# EAGLE design M623A (EAGLE 6.6.0)
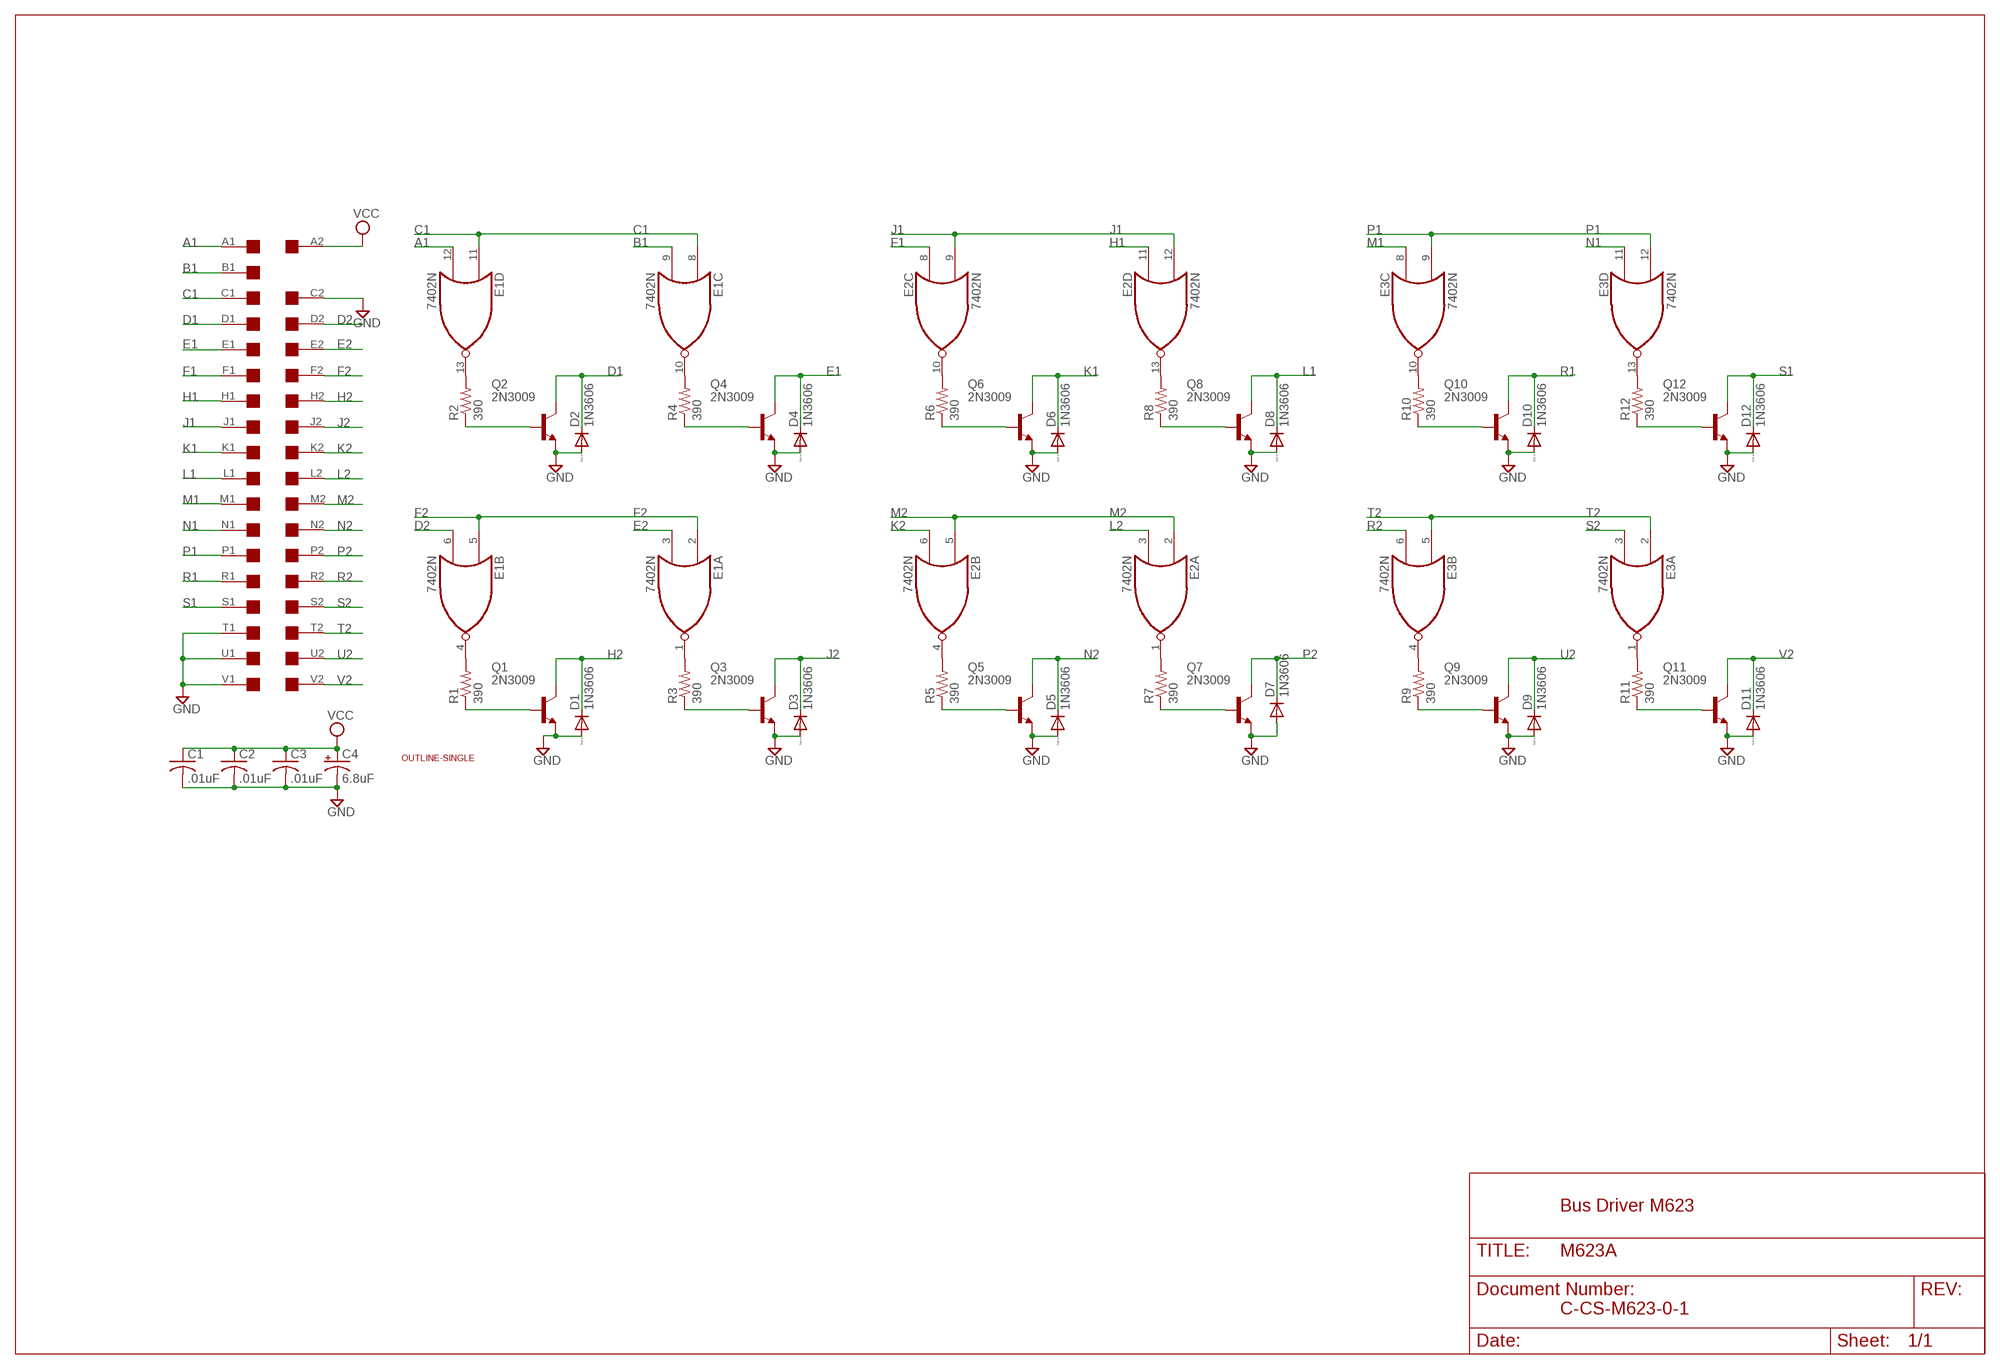
[diagram p0: schematic, sheet 1]

## Parts
C1  .01uF  C-US050-025X075  [C050-025X075]
C2  .01uF  C-US050-025X075  [C050-025X075]
C3  .01uF  C-US050-025X075  [C050-025X075]
C4  6.8uF  CPOL-USE15-5AXIAL  [E15-5]
D1  1N3606  1N4148DO35-10  [DO35-10]
D2  1N3606  1N4148DO35-10  [DO35-10]
D3  1N3606  1N4148DO35-10  [DO35-10]
D4  1N3606  1N4148DO35-10  [DO35-10]
D5  1N3606  1N4148DO35-10  [DO35-10]
D6  1N3606  1N4148DO35-10  [DO35-10]
D7  1N3606  1N4148DO35-10  [DO35-10]
D8  1N3606  1N4148DO35-10  [DO35-10]
D9  1N3606  1N4148DO35-10  [DO35-10]
D10  1N3606  1N4148DO35-10  [DO35-10]
D11  1N3606  1N4148DO35-10  [DO35-10]
D12  1N3606  1N4148DO35-10  [DO35-10]
E1  7402N  [DIL14]
E2  7402N  [DIL14]
E3  7402N  [DIL14]
Q1  2N3009  2N1613-NPN-TO39-EBC  [TO39]
Q2  2N3009  2N1613-NPN-TO39-EBC  [TO39]
Q3  2N3009  2N1613-NPN-TO39-EBC  [TO39]
Q4  2N3009  2N1613-NPN-TO39-EBC  [TO39]
Q5  2N3009  2N1613-NPN-TO39-EBC  [TO39]
Q6  2N3009  2N1613-NPN-TO39-EBC  [TO39]
Q7  2N3009  2N1613-NPN-TO39-EBC  [TO39]
Q8  2N3009  2N1613-NPN-TO39-EBC  [TO39]
Q9  2N3009  2N1613-NPN-TO39-EBC  [TO39]
Q10  2N3009  2N1613-NPN-TO39-EBC  [TO39]
Q11  2N3009  2N1613-NPN-TO39-EBC  [TO39]
Q12  2N3009  2N1613-NPN-TO39-EBC  [TO39]
R1  390  R-US_0207/10  [0207/10]
R2  390  R-US_0207/10  [0207/10]
R3  390  R-US_0207/10  [0207/10]
R4  390  R-US_0207/10  [0207/10]
R5  390  R-US_0207/10  [0207/10]
R6  390  R-US_0207/10  [0207/10]
R7  390  R-US_0207/10  [0207/10]
R8  390  R-US_0207/10  [0207/10]
R9  390  R-US_0207/10  [0207/10]
R10  390  R-US_0207/10  [0207/10]
R11  390  R-US_0207/10  [0207/10]
R12  390  R-US_0207/10  [0207/10]
U$1  OUTLINE-SINGLE  [SINGLE]
U$4  SINGLE  [EDGE-CON2]

## Nets
A1: E1.12(D:I1) U$4.A1
B1: E1.9(C:I1) U$4.B1
C1: E1.8(C:I0) E1.11(D:I0) U$4.C1
D1: D2.C Q2.3(C) U$4.D1
D2: E1.6(B:I1) U$4.D2
E1: D4.C Q4.3(C) U$4.E1
E2: E1.3(A:I1) U$4.E2
F1: E2.8(C:I0) U$4.F1
F2: E1.2(A:I0) E1.5(B:I0) U$4.F2
GND [Supply]: C1.2 C2.2 C3.2 C4.- D1.A D2.A D3.A D4.A D5.A D6.A D7.A D8.A D9.A D10.A D11.A D12.A Q1.1(E) Q2.1(E) Q3.1(E) Q4.1(E) Q5.1(E) Q6.1(E) Q7.1(E) Q8.1(E) Q9.1(E) Q10.1(E) Q11.1(E) Q12.1(E) U$4.C2 U$4.T1 U$4.U1 U$4.V1
H1: E2.11(D:I0) U$4.H1
H2: D1.C Q1.3(C) U$4.H2
J1: E2.9(C:I1) E2.12(D:I1) U$4.J1
J2: D3.C Q3.3(C) U$4.J2
K1: D6.C Q6.3(C) U$4.K1
K2: E2.6(B:I1) U$4.K2
L1: D8.C Q8.3(C) U$4.L1
L2: E2.3(A:I1) U$4.L2
M1: E3.8(C:I0) U$4.M1
M2: E2.2(A:I0) E2.5(B:I0) U$4.M2
N1: E3.11(D:I0) U$4.N1
N2: D5.C Q5.3(C) U$4.N2
N$1: E1.13(D:O) R2.2
N$2: Q2.2(B) R2.1
N$3: E1.4(B:O) R1.2
N$4: Q1.2(B) R1.1
N$12: E1.10(C:O) R4.2
N$13: E1.1(A:O) R3.2
N$14: E2.4(B:O) R5.2
N$15: E2.10(C:O) R6.2
N$16: E2.1(A:O) R7.2
N$17: E2.13(D:O) R8.2
N$18: E3.4(B:O) R9.2
N$19: E3.10(C:O) R10.2
N$20: E3.1(A:O) R11.2
N$21: E3.13(D:O) R12.2
N$22: Q12.2(B) R12.1
N$24: Q4.2(B) R4.1
N$25: Q6.2(B) R6.1
N$26: Q8.2(B) R8.1
N$27: Q10.2(B) R10.1
N$28: Q3.2(B) R3.1
N$29: Q5.2(B) R5.1
N$30: Q7.2(B) R7.1
N$31: Q9.2(B) R9.1
N$32: Q11.2(B) R11.1
P1: E3.9(C:I1) E3.12(D:I1) U$4.P1
P2: D7.C Q7.3(C) U$4.P2
R1: D10.C Q10.3(C) U$4.R1
R2: E3.6(B:I1) U$4.R2
S1: D12.C Q12.3(C) U$4.S1
S2: E3.3(A:I1) U$4.S2
T2: E3.2(A:I0) E3.5(B:I0) U$4.T2
U2: D9.C Q9.3(C) U$4.U2
V2: D11.C Q11.3(C) U$4.V2
VCC [Supply]: C1.1 C2.1 C3.1 C4.+ U$4.A2
Unconnected: U$4.B2

## Notes on the sheet
- Bus Driver M623
- C-CS-M623-0-1

## Power pins joined to a net without a drawn wire
GND: E1.7(P:GND) E2.7(P:GND) E3.7(P:GND)
VCC: E1.14(P:VCC) E2.14(P:VCC) E3.14(P:VCC)

## Library data of the parts
C1-C3 = rcl:C-US: CAPACITOR, American symbol
C4 = dec-con:CPOL-USE15-5AXIAL: 0.5" veresion of an electrolytic
D1-D12 = diode:1N4148: DIODE high speed (Philips)
E1-E3 = 74xx-us:74*02: Quad 2-input NOR gate
Q1-Q12 = transistor:*-NPN-: NPN Transistror BF959 corrected 2008.03.06
R1-R12 = rcl:R-US_: RESISTOR, American symbol
U$1 = dec-con:OUTLINE-*: Board outlines for DEC boards.
U$4 = dec-con:SINGLE: Single-Height DEC board

## Net classes
1 Supply: width 0.813 mm

## Board
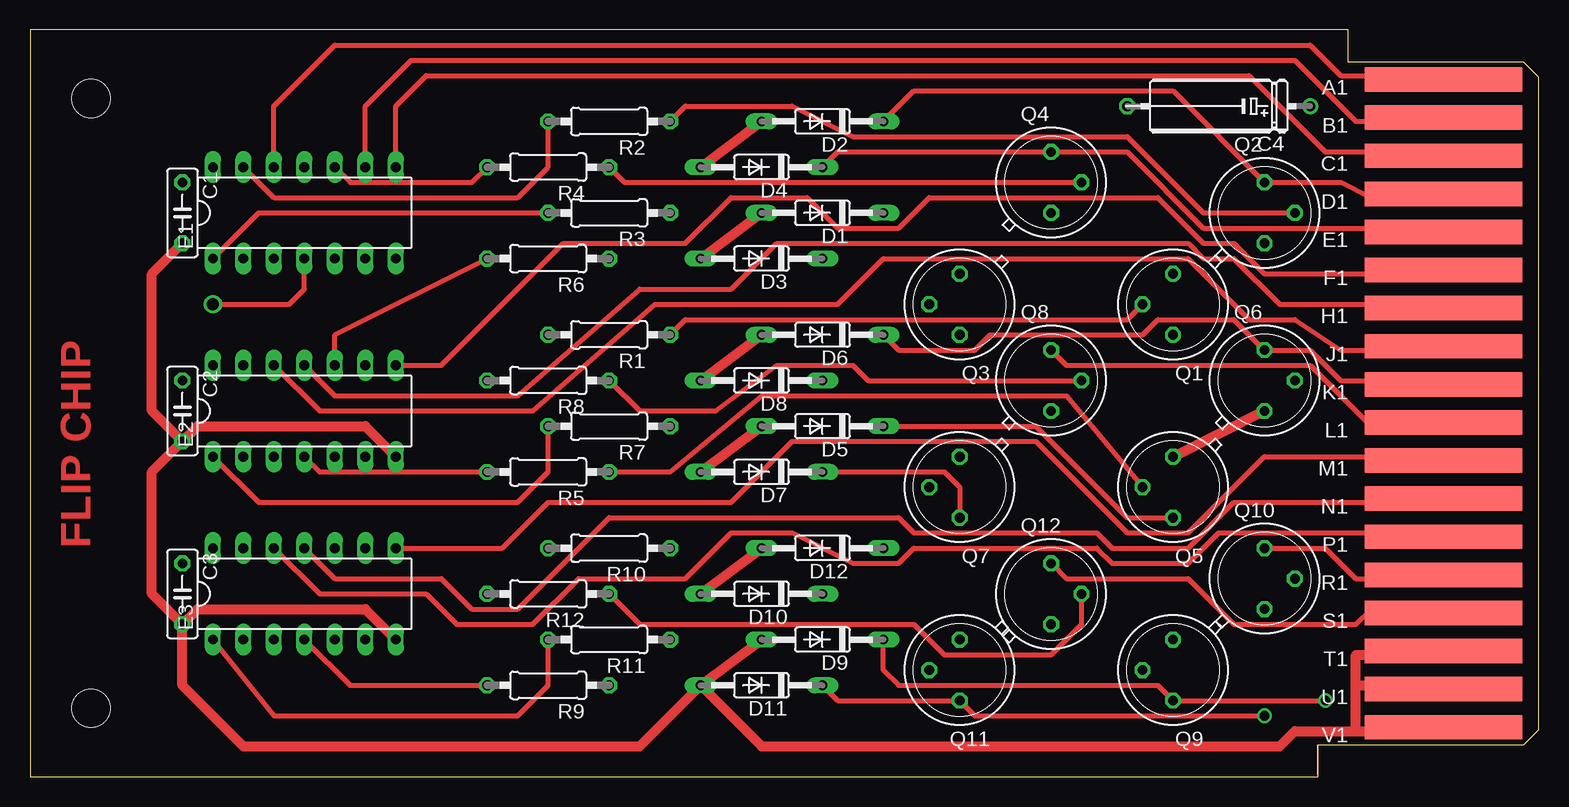
[diagram p1: board, top side]
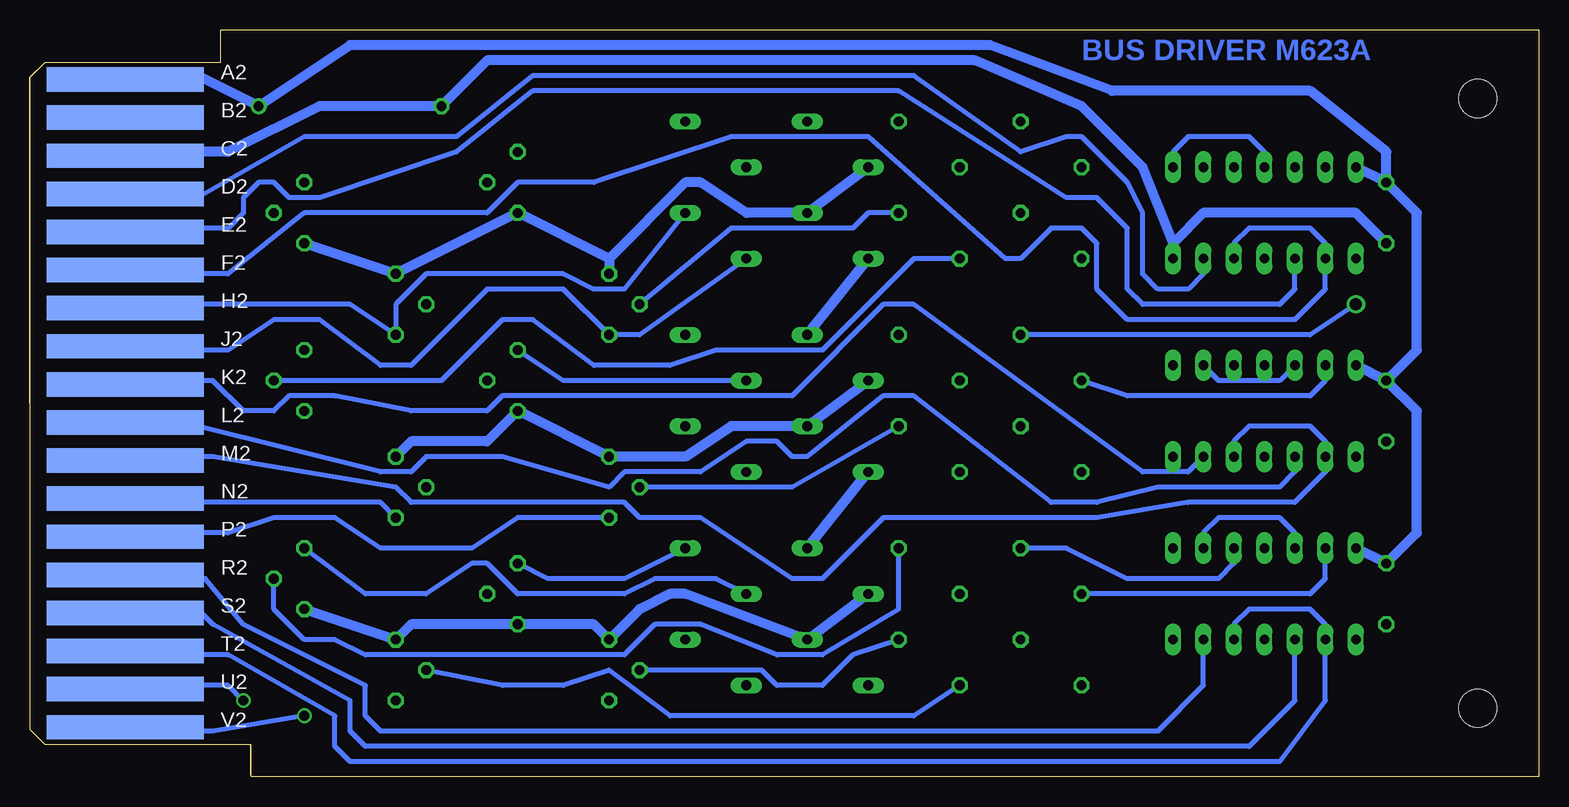
[diagram p2: board, bottom side, seen from below]

Size 125.73 x 62.23 mm. Coordinates in mm from the lower left corner, seen from the top.
Copper layers (1+16): Top 0.035mm / dielectric 1.5mm / Bottom 0.035mm
Design rules "16mils": minimum track width 16mil, minimum drill 32mil, track to track 15mil, track to pad 10mil, pad to pad 10mil, via to via 10mil, smd to smd 10mil, copper to edge 13mil, drill to drill 10mil, minimum pad ring 10mil, minimum via ring 8mil, stop-mask expansion 0mil, vias tented up to drill 0mil, thermal gap 10mil

### Footprints (pad centres in the part's own frame; a part is rotated, then mirrored left to right if it is on the bottom)
C050-025X075 = drill 0.813 octagon: 1 -2.54,0; 2 2.54,0
E15-5 = drill 0.813: + -7.62,0 | drill 0.813 octagon: - 7.62,0
DO35-10 = drill 0.813 long: A 5.08,0; C -5.08,0
DIL14 = drill 0.813 long: 1 -7.62,-3.81; 2 -5.08,-3.81; 3 -2.54,-3.81; 4 0,-3.81; 5 2.54,-3.81; 6 5.08,-3.81; 7 7.62,-3.81; 8 7.62,3.81; 9 5.08,3.81; 10 2.54,3.81; 11 0,3.81; 12 -2.54,3.81; 13 -5.08,3.81; 14 -7.62,3.81
TO39 = drill 0.813 octagon: 1 0,-2.54; 2 2.54,0; 3 0,2.54
0207/10 = drill 0.813 octagon: 1 -5.08,0; 2 5.08,0
SINGLE = hole 3.175: 120.65,56.515; 120.65,5.715
EDGE-CON2 = smd 13.106 x 2.032: A1 7.938,4.128; B1 7.938,7.303; C1 7.938,10.477; D1 7.938,13.652; E1 7.938,16.828; F1 7.938,20.003; H1 7.938,23.177; J1 7.938,26.352; K1 7.938,29.527; L1 7.938,32.703; M1 7.938,35.877; N1 7.938,39.053; P1 7.938,42.227; R1 7.938,45.403; S1 7.938,48.578; T1 7.938,51.752; U1 7.938,54.928; V1 7.938,58.102 | smd 13.106 x 2.032 bottom: A2 7.938,4.128; B2 7.938,7.303; C2 7.938,10.477; D2 7.938,13.652; E2 7.938,16.828; F2 7.938,20.003; H2 7.938,23.177; J2 7.938,26.352; K2 7.938,29.527; L2 7.938,32.703; M2 7.938,35.877; N2 7.938,39.053; P2 7.938,42.227; R2 7.938,45.403; S2 7.938,48.578; T2 7.938,51.752; U2 7.938,54.928; V2 7.938,58.102

### Placement (x,y rotation side)
C1  12.7,46.99 270 top
C2  12.7,30.48 270 top
C3  12.7,15.24 270 top
C4  99.06,55.88 180 top
D1  66.04,46.99 180 top
D2  66.04,54.61 180 top
D3  60.96,43.18 180 top
D4  60.96,50.8 180 top
D5  66.04,29.21 180 top
D6  66.04,36.83 180 top
D7  60.96,25.4 180 top
D8  60.96,33.02 180 top
D9  66.04,11.43 180 top
D10  60.96,15.24 180 top
D11  60.96,7.62 180 top
D12  66.04,19.05 180 top
E1  22.86,46.99 0 top
E2  22.86,30.48 0 top
E3  22.86,15.24 0 top
Q1  95.25,39.37 180 top
Q2  102.87,46.99 0 top
Q3  77.47,39.37 180 top
Q4  85.09,49.53 0 top
Q5  95.25,24.13 180 top
Q6  102.87,33.02 0 top
Q7  77.47,24.13 180 top
Q8  85.09,33.02 0 top
Q9  95.25,8.89 180 top
Q10  102.87,16.51 0 top
Q11  77.47,8.89 180 top
Q12  85.09,15.24 0 top
R1  48.26,36.83 180 top
R2  48.26,54.61 180 top
R3  48.26,46.99 180 top
R4  43.18,50.8 180 top
R5  43.18,25.4 180 top
R6  43.18,43.18 180 top
R7  48.26,29.21 180 top
R8  43.18,33.02 180 top
R9  43.18,7.62 180 top
R10  48.26,19.05 180 top
R11  48.26,11.43 180 top
R12  43.18,15.24 180 top
U$1  125.73,62.23 180 top
U$2  [FLIPCHIP]  0,0 0 top
U$4  125.73,62.23 180 top

### Tracks (layer width: path | path; a pad name or v marks a point on that pad's centre or on a via)
A1
  Top 0.406: E1.12 20.32,55.88 25.4,60.96 106.68,60.96 109.22,58.42 116.84,58.42 U$4.A1
B1
  Top 0.406: E1.9 27.94,55.88 31.75,59.69 105.41,59.69 110.49,54.61 116.84,54.61 U$4.B1
C1
  Top 0.406: E1.8 30.48,55.88 33.02,58.42 101.6,58.42 107.95,52.07 116.84,52.07 U$4.C1
  Bottom 0.406: E1.11 22.86,52.07 24.13,53.34 29.21,53.34 30.48,52.07 E1.8
D1
  Top 0.406: U$4.D1 116.84,48.26 111.76,48.26 109.22,49.53 Q2.3 95.25,57.15 73.66,57.15 D2.C
D2
  Bottom 0.406: U$4.D2 116.84,48.26 111.76,48.26 102.87,53.34 90.17,53.34 83.82,58.42 52.07,58.42 43.18,52.07 39.37,53.34 38.1,53.34 36.83,52.07 34.29,49.53 33.02,46.99 33.02,41.91 31.75,40.64 29.21,40.64 27.94,41.91 E1.6
E1
  Top 0.406: U$4.E1 116.84,45.72 97.79,45.72 91.44,52.07 Q4.3 67.31,52.07 D4.C
E2
  Bottom 0.406: E1.3 20.32,40.64 21.59,39.37 33.02,39.37 34.29,40.64 34.29,45.72 36.83,48.26 39.37,48.26 53.34,57.15 83.82,57.15 90.17,52.07 101.6,48.26 104.14,48.26 105.41,49.53 106.68,49.53 107.95,48.26 107.95,46.99 109.22,45.72 116.84,45.72 U$4.E2
F1
  Top 0.406: E2.8 34.29,34.29 44.45,44.45 54.61,44.45 58.42,48.26 64.77,48.26 67.31,45.72 72.39,45.72 74.93,48.26 93.98,48.26 97.79,44.45 100.33,44.45 102.87,41.91 116.84,41.91 U$4.F1
F2
  Bottom 0.406: E1.5 25.4,44.45 24.13,45.72 19.05,45.72 17.78,44.45 E1.2 17.78,40.64 20.32,38.1 34.29,38.1 36.83,40.64 36.83,44.45 38.1,45.72 40.64,45.72 43.18,43.18 44.45,43.18 55.88,53.34 67.31,53.34 78.74,49.53 85.09,49.53 87.63,46.99 102.87,46.99 109.22,41.91 116.84,41.91 U$4.F2
GND
  Top 0.813: U$4.V1 116.84,3.81 110.49,3.81 | 110.49,3.81 110.49,7.62 | 110.49,7.62 110.49,10.16 116.84,10.16 U$4.T1 | U$4.U1 116.84,7.62 110.49,7.62 | D11.A D9.A | D10.A D12.A | D7.A D5.A | D8.A D6.A | D3.A D1.A | D4.A D2.A | 110.49,3.81 105.41,3.81 104.14,2.54 60.96,2.54 D11.A | C3.2 12.7,7.62 17.78,2.54 50.8,2.54 D11.A | C1.2 10.16,41.91 10.16,30.48 C2.2 | C2.2 10.16,25.4 10.16,15.24 C3.2 | Q5.1 Q6.1 | E2.7 27.94,29.21 13.97,29.21 C2.2 | E3.7 27.94,13.97 13.97,13.97 C3.2
  Bottom 0.813: D4.A D1.A 66.04,46.99 69.85,49.53 71.12,49.53 77.47,43.18 | D6.A D3.A | D8.A D5.A 67.31,29.21 71.12,26.67 Q7.1 Q8.1 87.63,27.94 93.98,27.94 Q5.1 | D12.A D7.A | D10.A D9.A 71.12,15.24 72.39,15.24 74.93,13.97 Q11.1 78.74,12.7 Q12.1 93.98,12.7 Q9.1 Q10.1 | 30.48,44.45 E1.7 | 30.48,44.45 27.94,46.99 15.24,46.99 C1.2 | 30.48,44.45 33.02,50.8 38.1,55.88 46.99,59.69 87.63,59.69 C4.- 101.6,55.88 109.22,52.07 116.84,52.07 U$4.C2 | 77.47,43.18 Q3.1 | 77.47,43.18 Q4.1 Q1.1 Q2.1
H1
  Top 0.406: E2.11 25.4,31.75 40.64,31.75 50.8,40.64 58.42,40.64 62.23,44.45 96.52,44.45 97.79,43.18 100.33,43.18 104.14,39.37 116.84,39.37 U$4.H1
H2
  Bottom 0.406: D1.C 76.2,40.64 78.74,40.64 81.28,41.91 92.71,41.91 95.25,39.37 Q1.3 99.06,39.37 116.84,39.37 U$4.H2
J1
  Top 0.406: E2.12 24.13,30.48 41.91,30.48 52.07,39.37 67.31,39.37 71.12,43.18 96.52,43.18 101.6,38.1 105.41,38.1 109.22,35.56 116.84,35.56 U$4.J1
  Bottom 0.406: E2.12 21.59,33.02 26.67,33.02 E2.9
J2
  Bottom 0.406: D3.C 74.93,36.83 Q3.3 81.28,40.64 87.63,40.64 93.98,34.29 96.52,34.29 101.6,38.1 105.41,38.1 109.22,35.56 116.84,35.56 U$4.J2
K1
  Top 0.406: U$4.K1 116.84,33.02 109.22,33.02 106.68,35.56 Q6.3 100.33,38.1 93.98,38.1 92.71,36.83 80.01,36.83 78.74,35.56 72.39,35.56 D6.C
K2
  Bottom 0.406: E2.6 29.21,25.4 33.02,25.4 52.07,39.37 54.61,39.37 62.23,31.75 86.36,31.75 87.63,30.48 93.98,30.48 100.33,31.75 104.14,31.75 105.41,30.48 107.95,30.48 110.49,33.02 116.84,33.02 U$4.K2
L1
  Top 0.406: U$4.L1 116.84,29.21 111.76,29.21 106.68,34.29 86.36,34.29 Q8.3
  Bottom 0.406: D8.C 81.28,33.02 Q8.3
L2
  Bottom 0.406: E2.3 20.32,25.4 21.59,24.13 31.75,24.13 36.83,22.86 40.64,22.86 52.07,31.75 54.61,31.75 60.96,26.67 62.23,26.67 63.5,27.94 66.04,27.94 69.85,25.4 76.2,25.4 77.47,24.13 86.36,26.67 92.71,26.67 93.98,25.4 96.52,25.4 111.76,29.21 116.84,29.21 U$4.L2
M1
  Top 0.406: E3.8 39.37,19.05 43.18,22.86 58.42,22.86 63.5,27.94 83.82,27.94 91.44,20.32 96.52,20.32 102.87,26.67 116.84,26.67 U$4.M1
M2
  Bottom 0.406: E2.5 25.4,27.94 24.13,29.21 19.05,29.21 17.78,27.94 E2.2 17.78,25.4 20.32,22.86 29.21,22.86 36.83,21.59 54.61,21.59 59.69,16.51 62.23,16.51 69.85,21.59 74.93,21.59 76.2,22.86 93.98,22.86 95.25,24.13 110.49,26.67 116.84,26.67 U$4.M2
N1
  Top 0.406: E3.11 25.4,16.51 34.29,16.51 36.83,13.97 40.64,13.97 48.26,21.59 72.39,21.59 73.66,20.32 88.9,20.32 90.17,19.05 96.52,19.05 100.33,22.86 116.84,22.86 U$4.N1
N2
  Top 0.406: D5.C 83.82,29.21 91.44,21.59 Q5.3
  Bottom 0.406: U$4.N2 116.84,22.86 96.52,22.86 Q5.3
N$1
  Top 0.406: E1.13 20.32,48.26 40.64,48.26 43.18,50.8 R2.2
N$2
  Top 0.406: R2.1 54.61,55.88 63.5,55.88 68.58,53.34 91.44,53.34 97.79,46.99 Q2.2
N$3  (via drill 1.02)
  Top 0.406: v15.24,39.37 21.59,39.37 22.86,40.64 E1.4
  Bottom 0.406: R1.2 19.05,36.83 v15.24,39.37
N$4
  Top 0.406: R1.1 54.61,38.1 91.44,38.1 Q1.2
N$12
  Top 0.406: E1.10 26.67,49.53 36.83,49.53 R4.2
N$13
  Top 0.406: R3.2 19.05,46.99 E1.1
N$14
  Top 0.406: R5.2 24.13,25.4 E2.4
N$15
  Top 0.406: E2.10 25.4,36.83 R6.2
N$16
  Top 0.406: E2.1 19.05,22.86 40.64,22.86 43.18,25.4 R7.2
N$17
  Bottom 0.406: E2.13 17.78,33.02 19.05,31.75 34.29,31.75 R8.2
N$18
  Top 0.406: R9.2 26.67,7.62 E3.4
N$19
  Bottom 0.406: E3.10 25.4,17.78 26.67,16.51 34.29,16.51 39.37,19.05 R10.2
N$20
  Top 0.406: E3.1 20.32,5.08 40.64,5.08 43.18,7.62 R11.2
N$21
  Bottom 0.406: E3.13 17.78,16.51 19.05,15.24 R12.2
N$22
  Top 0.406: Q12.2 87.63,12.7 85.09,10.16 76.2,10.16 73.66,12.7 50.8,12.7 R12.1
N$24
  Top 0.406: Q4.2 49.53,49.53 R4.1
N$25
  Bottom 0.406: R6.1 52.07,43.18 59.69,35.56 68.58,35.56 72.39,34.29 78.74,34.29 83.82,38.1 86.36,38.1 91.44,33.02 Q6.2
N$26
  Top 0.406: R8.1 50.8,30.48 57.15,30.48 62.23,34.29 68.58,34.29 69.85,33.02 Q8.2
N$27
  Bottom 0.406: R10.1 53.34,13.97 59.69,10.16 63.5,10.16 69.85,12.7 73.66,12.7 76.2,10.16 97.79,10.16 100.33,11.43 102.87,11.43 105.41,13.97 Q10.2
N$28
  Bottom 0.406: R3.1 55.88,46.99 57.15,45.72 67.31,45.72 Q3.2
N$29
  Top 0.406: R5.1 53.34,25.4 60.96,31.75 86.36,31.75 Q5.2
N$30
  Bottom 0.406: R7.1 62.23,24.13 Q7.2
N$31
  Bottom 0.406: R9.1 52.07,5.08 72.39,5.08 77.47,8.89 81.28,7.62 86.36,7.62 Q9.2
N$32
  Bottom 0.406: R11.1 57.15,10.16 59.69,7.62 63.5,7.62 64.77,8.89 Q11.2
P1
  Top 0.406: E3.12 24.13,15.24 33.02,15.24 35.56,12.7 41.91,12.7 45.72,16.51 54.61,16.51 58.42,20.32 63.5,20.32 68.58,17.78 72.39,17.78 73.66,19.05 88.9,19.05 90.17,17.78 96.52,17.78 99.06,20.32 116.84,20.32 U$4.P1
  Bottom 0.406: E3.12 20.32,20.32 21.59,21.59 26.67,21.59 27.94,20.32 E3.9
P2
  Top 0.406: D7.C 76.2,25.4 77.47,24.13 Q7.3
  Bottom 0.406: U$4.P2 116.84,20.32 109.22,20.32 105.41,21.59 100.33,21.59 96.52,19.05 88.9,19.05 85.09,21.59 Q7.3
R1
  Top 0.406: U$4.R1 116.84,16.51 110.49,16.51 107.95,19.05 Q10.3
  Bottom 0.406: D10.C 68.58,16.51 73.66,16.51 76.2,15.24 85.09,15.24 87.63,17.78 88.9,17.78 92.71,15.24 97.79,15.24 Q10.3
R2
  Bottom 0.406: U$4.R2 116.84,16.51 111.12,16.51 107.95,12.7 97.79,7.62 97.79,5.08 96.52,3.81 31.75,3.81 27.94,7.62 E3.6
S1
  Top 0.406: U$4.S1 116.84,13.97 111.76,13.97 110.49,12.7 100.33,12.7 96.52,16.51 86.36,16.51 Q12.3
  Bottom 0.406: Q12.3 82.55,16.51 76.2,16.51 D12.C
S2
  Bottom 0.406: E3.3 20.32,6.35 24.13,2.54 97.79,2.54 99.06,3.81 99.06,6.35 110.49,12.7 111.76,13.97 116.84,13.97 U$4.S2
T2
  Bottom 0.406: U$4.T2 117.17,10.49 116.84,10.16 109.22,10.16 100.33,5.08 100.33,2.54 99.06,1.27 21.59,1.27 17.78,6.35 E3.2 17.78,12.7 19.05,13.97 24.13,13.97 25.4,12.7 E3.5
U2  (via drill 0.81)
  Top 0.406: v107.95,6.35 Q9.3 93.98,7.62 72.39,7.62 71.12,8.89 D9.C
  Bottom 0.406: U$4.U2 116.84,7.62 109.22,7.62 v107.95,6.35
V2  (via drill 0.81)
  Top 0.406: v102.87,5.08 78.74,5.08 Q11.3 67.31,6.35 D11.C
  Bottom 0.406: U$4.V2 116.84,3.81 110.49,3.81 v102.87,5.08
VCC
  Bottom 0.813: E3.14 C3.1 10.16,20.32 10.16,30.48 C2.1 | C1.1 10.16,46.99 10.16,35.56 C2.1 | C2.1 E2.14 | C1.1 E1.14 | U$4.A2 116.84,58.42 111.76,58.42 C4.+ 99.06,60.96 45.72,60.96 35.56,57.15 19.05,57.15 12.7,52.07 C1.1

### Text on the board
Bottom: BUS DRIVER M623A